# EAGLE design Sensor_IBIS5 (EAGLE 9.6.2)
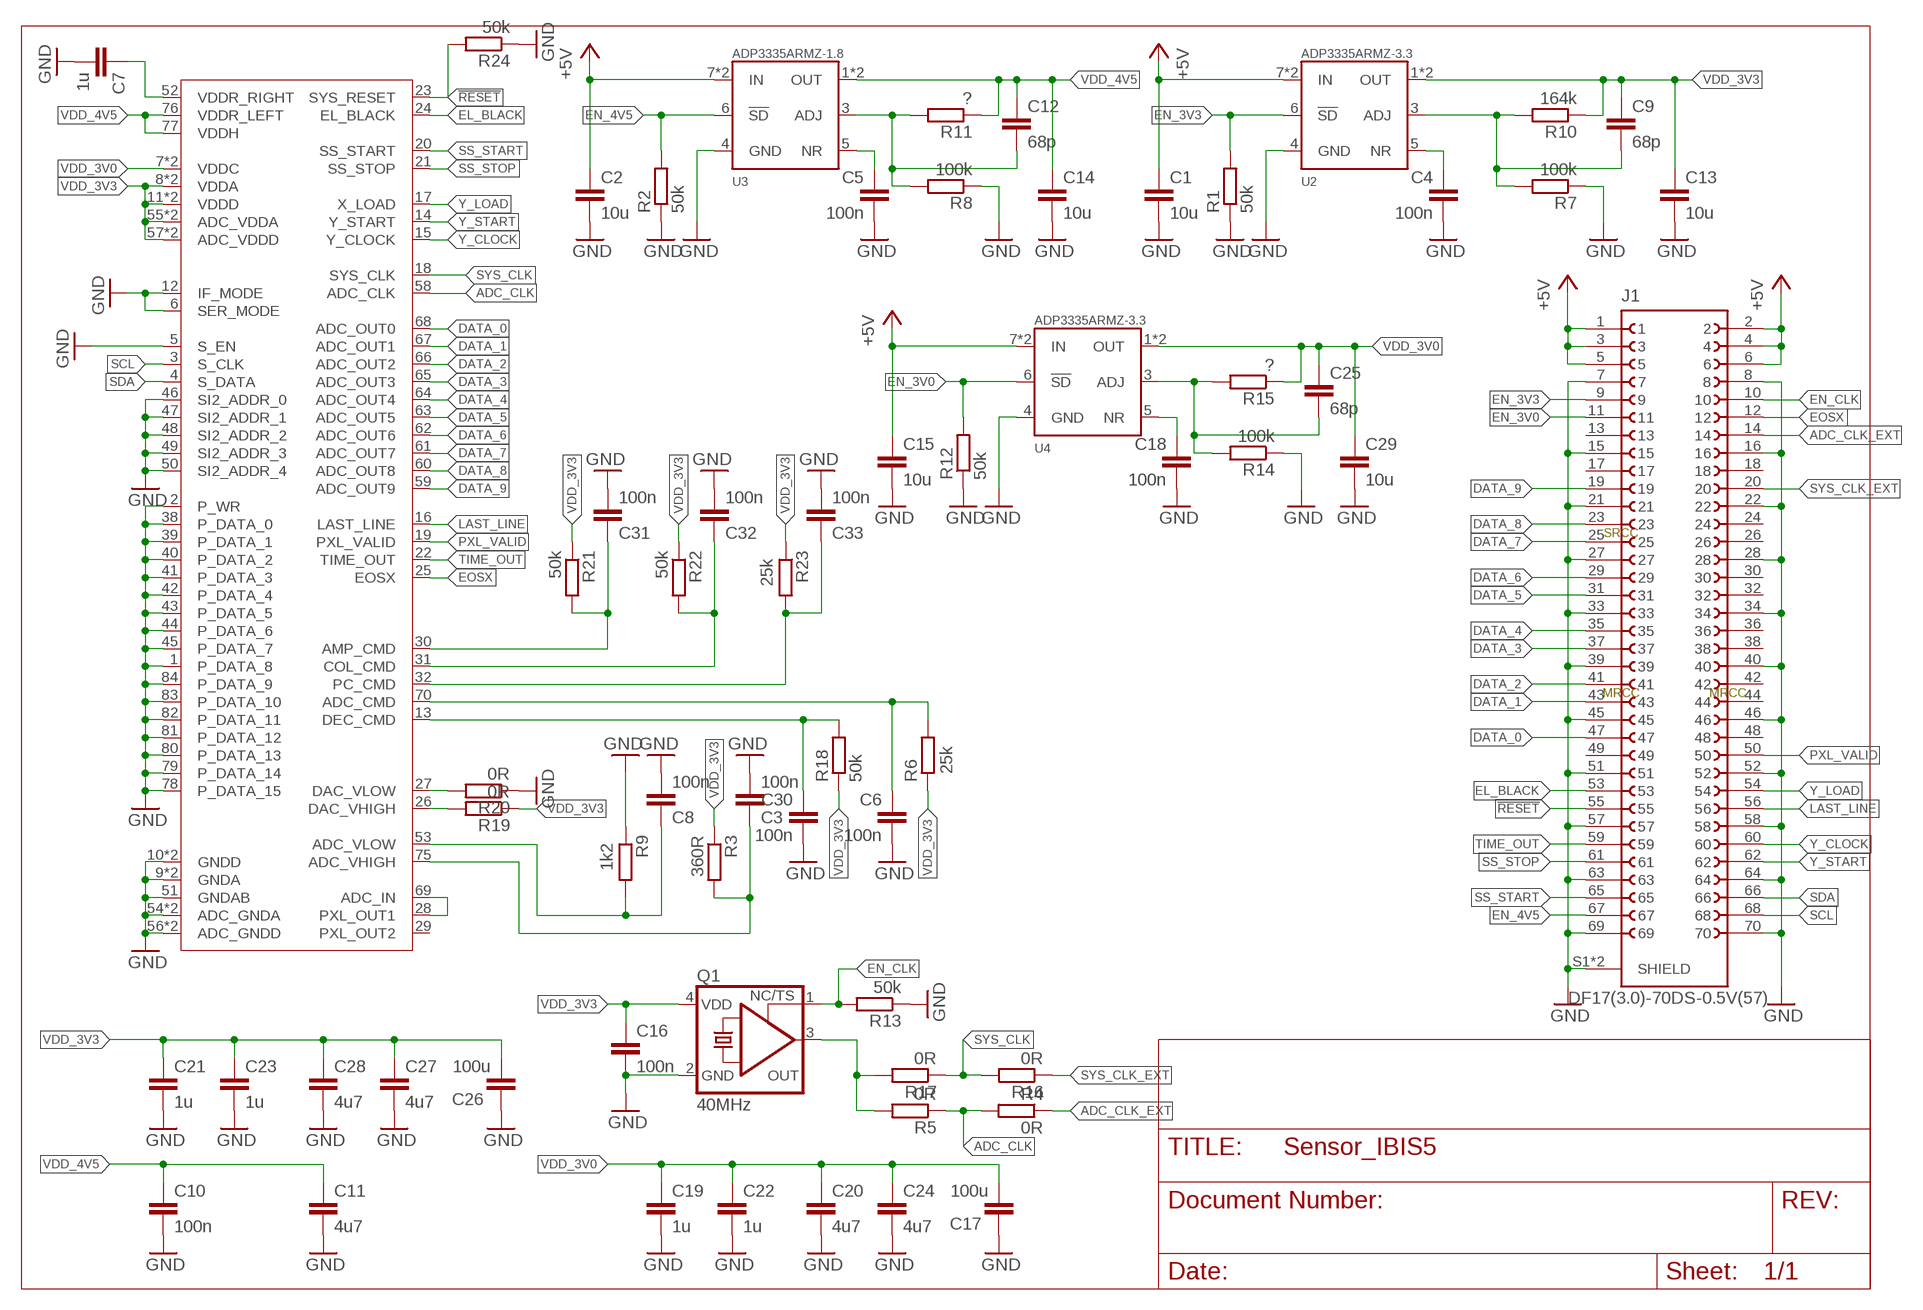
[diagram p0: schematic, sheet 1]

## Parts
C1  10u  C-EUC0603  [C0603]
C2  10u  C-EUC0603  [C0603]
C3  100n  C-EUC0402  [C0402]
C4  100n  C-EUC0402  [C0402]
C5  100n  C-EUC0402  [C0402]
C6  100n  C-EUC0402  [C0402]
C7  1u  C-EUC0402  [C0402]
C8  100n  C-EUC0402  [C0402]
C9  68p  C-EUC0402  [C0402]
C10  100n  C-EUC0402  [C0402]
C11  4u7  C-EUC0603  [C0603]
C12  68p  C-EUC0402  [C0402]
C13  10u  C-EUC0603  [C0603]
C14  10u  C-EUC0603  [C0603]
C15  10u  C-EUC0603  [C0603]
C16  100n  C-EUC0402  [C0402]
C17  100u  C-EUC1206  [C1206]
C18  100n  C-EUC0402  [C0402]
C19  1u  C-EUC0402  [C0402]
C20  4u7  C-EUC0603  [C0603]
C21  1u  C-EUC0402  [C0402]
C22  1u  C-EUC0402  [C0402]
C23  1u  C-EUC0402  [C0402]
C24  4u7  C-EUC0603  [C0603]
C25  68p  C-EUC0402  [C0402]
C26  100u  C-EUC1206  [C1206]
C27  4u7  C-EUC0603  [C0603]
C28  4u7  C-EUC0603  [C0603]
C29  10u  C-EUC0603  [C0603]
C30  100n  C-EUC0402  [C0402]
C31  100n  C-EUC0402  [C0402]
C32  100n  C-EUC0402  [C0402]
C33  100n  C-EUC0402  [C0402]
J1  DF17(3.0)-70DS-0.5V(57)  [DF17(3.0)-70DS-0.5V(57)]
Q1  40MHz  KXO-PXO/XO-V96  [3.2X2.5_KXO-V96]
R1  50k  R-EU_R0402  [R0402]
R2  50k  R-EU_R0402  [R0402]
R3  360R  R-EU_R0402  [R0402]
R4  0R  R-EU_R0402  [R0402]
R5  0R  R-EU_R0402  [R0402]
R6  25k  R-EU_R0402  [R0402]
R7  100k  R-EU_R0402  [R0402]
R8  100k  R-EU_R0402  [R0402]
R9  1k2  R-EU_R0402  [R0402]
R10  164k  R-EU_R0402  [R0402]
R11  ?  R-EU_R0402  [R0402]
R12  50k  R-EU_R0402  [R0402]
R13  50k  R-EU_R0402  [R0402]
R14  100k  R-EU_R0402  [R0402]
R15  ?  R-EU_R0402  [R0402]
R16  0R  R-EU_R0402  [R0402]
R17  0R  R-EU_R0402  [R0402]
R18  50k  R-EU_R0402  [R0402]
R19  0R  R-EU_R0402  [R0402]
R20  0R  R-EU_R0402  [R0402]
R21  50k  R-EU_R0402  [R0402]
R22  50k  R-EU_R0402  [R0402]
R23  25k  R-EU_R0402  [R0402]
R24  50k  R-EU_R0402  [R0402]
U1  CYII5FM1300AB  [LCC-84]
U2  ADP3335ARMZ-3.3  NCP3335  [MSOP08]
U3  ADP3335ARMZ-1.8  NCP3335  [MSOP08]
U4  ADP3335ARMZ-3.3  NCP3335  [MSOP08]

## Nets
!RESET: J1.55 R24.2 U1.23(SYS_RESET)
+5V: C1.1 C2.1 C15.1 J1.1 J1.2 J1.3 J1.4 J1.5 J1.6 U2.7(IN) U2.8(IN) U3.7(IN) U3.8(IN) U4.7(IN) U4.8(IN)
ADC_CLK: R4.2 R5.1 U1.58(ADC_CLK)
ADC_CLK_EXT: J1.14 R4.1
CLK: Q1.3(OUT) R5.2 R17.2
DATA_0: J1.47 U1.68(ADC_OUT0)
DATA_1: J1.43 U1.67(ADC_OUT1)
DATA_2: J1.41 U1.66(ADC_OUT2)
DATA_3: J1.37 U1.65(ADC_OUT3)
DATA_4: J1.35 U1.64(ADC_OUT4)
DATA_5: J1.31 U1.63(ADC_OUT5)
DATA_6: J1.29 U1.62(ADC_OUT6)
DATA_7: J1.25 U1.61(ADC_OUT7)
DATA_8: J1.23 U1.60(ADC_OUT8)
DATA_9: J1.19 U1.59(ADC_OUT9)
EL_BLACK: J1.53 U1.24(EL_BLACK)
EN_3V0: J1.11 R12.2 U4.6(!SD)
EN_3V3: J1.9 R1.2 U2.6(!SD)
EN_4V5: J1.67 R2.2 U3.6(!SD)
EN_CLK: J1.10 Q1.1(TS) R13.2
EOSX: J1.12 U1.25(EOSX)
GND: C1.2 C2.2 C3.2 C4.2 C5.2 C6.2 C7.2 C8.2 C10.2 C11.2 C13.2 C14.2 C15.2 C16.2 C17.2 C18.2 C19.2 C20.2 C21.2 C22.2 C23.2 C24.2 C26.2 C27.2 C28.2 C29.2 C30.2 C31.2 C32.2 C33.2 J1.7 J1.8 J1.15 J1.16 J1.21 J1.22 J1.27 J1.28 J1.33 J1.34 J1.39 J1.40 J1.45 J1.46 J1.51 J1.52 J1.57 J1.58 J1.63 J1.64 J1.69 J1.70 J1.S1(SHIELD) J1.S2(SHIELD) Q1.2(GND) R1.1 R2.1 R7.1 R8.1 R9.1 R12.1 R13.1 R14.1 R20.1 R24.1 U1.1(P_DATA_8) U1.2(P_WR) U1.5(S_EN) U1.6(SER_MODE) U1.9(GNDA) U1.10(GNDD) U1.12(IF_MODE) U1.34(GNDD) U1.35(GNDA) U1.38(P_DATA_0) U1.39(P_DATA_1) U1.40(P_DATA_2) U1.41(P_DATA_3) U1.42(P_DATA_4) U1.43(P_DATA_5) U1.44(P_DATA_6) U1.45(P_DATA_7) U1.46(SI2_ADDR_0) U1.47(SI2_ADDR_1) U1.48(SI2_ADDR_2) U1.49(SI2_ADDR_3) U1.50(SI2_ADDR_4) U1.51(GNDAB) U1.54(ADC_GNDA) U1.56(ADC_GNDD) U1.72(ADC_GNDA) U1.73(ADC_GNDD) U1.78(P_DATA_15) U1.79(P_DATA_14) U1.80(P_DATA_13) U1.81(P_DATA_12) U1.82(P_DATA_11) U1.83(P_DATA_10) U1.84(P_DATA_9) U2.4(GND) U3.4(GND) U4.4(GND)
LAST_LINE: J1.56 U1.16(LAST_LINE)
N$00001: U1.28(PXL_OUT1) U1.69(ADC_IN)
N$00002: C18.1 U4.5(NR)
N$00003: C5.1 U3.5(NR)
N$00004: C4.1 U2.5(NR)
N$00005: R19.2 U1.26(DAC_VHIGH)
N$00006: R20.2 U1.27(DAC_VLOW)
N$00007: C30.1 R18.2 U1.13(DEC_CMD)
N$00008: C32.1 R22.2 U1.31(COL_CMD)
N$00009: C33.1 R23.2 U1.32(PC_CMD)
N$00010: C31.1 R21.2 U1.30(AMP_CMD)
N$00011: C6.1 R6.2 U1.70(ADC_CMD)
N$00012: C3.1 R3.2 U1.75(ADC_VHIGH)
N$00013: C8.1 R9.2 U1.53(ADC_VLOW)
N$00014: C7.1 U1.52(VDDR_RIGHT)
N$00015: C12.2 R8.2 R11.2 U3.3(ADJ)
N$00016: C9.2 R7.2 R10.2 U2.3(ADJ)
N$00017: C25.2 R14.2 R15.2 U4.3(ADJ)
PXL_VALID: J1.50 U1.19(PXL_VALID)
SCL: J1.68 U1.3(S_CLK)
SDA: J1.66 U1.4(S_DATA)
SS_START: J1.65 U1.20(SS_START)
SS_STOP: J1.61 U1.21(SS_STOP)
SYS_CLK: R16.2 R17.1 U1.18(SYS_CLK)
SYS_CLK_EXT: J1.20 R16.1
TIME_OUT: J1.59 U1.22(TIME_OUT)
VDD_3V0: C17.1 C19.1 C20.1 C22.1 C24.1 C25.1 C29.1 R15.1 U1.7(VDDC) U1.37(VDDC) U4.1(OUT) U4.2(OUT)
VDD_3V3: C9.1 C13.1 C16.1 C21.1 C23.1 C26.1 C27.1 C28.1 Q1.4(VDD) R3.1 R6.1 R10.1 R18.1 R19.1 R21.1 R22.1 R23.1 U1.8(VDDA) U1.11(VDDD) U1.33(VDDD) U1.36(VDDA) U1.55(ADC_VDDA) U1.57(ADC_VDDD) U1.71(ADC_VDDD) U1.74(ADC_VDDA) U2.1(OUT) U2.2(OUT)
VDD_4V5: C10.1 C11.1 C12.1 C14.1 R11.1 U1.76(VDDR_LEFT) U1.77(VDDH) U3.1(OUT) U3.2(OUT)
Y_CLOCK: J1.60 U1.15(Y_CLOCK)
Y_LOAD: J1.54 U1.17(X_LOAD)
Y_START: J1.62 U1.14(Y_START)
Unconnected: J1.13 J1.17 J1.18 J1.24 J1.26 J1.30 J1.32 J1.36 J1.38 J1.42 J1.44 J1.48 J1.49 U1.29(PXL_OUT2)

## Notes on the sheet
- SRCC
- MRCC | MRCC

## Library data of the parts
C1 C2 C7 C13-C15 C19 C21-C23 C29 = rcl:C-EU: CAPACITOR, European symbol; SPICEPREFIX: C
C3-C6 C8-C10 C12 C18 C25 C30-C33 = rcl:C-EU: CAPACITOR, European symbol; LCSC: C1525; SPICEPREFIX: C
C11 C20 C24 C27 C28 = rcl:C-EU: CAPACITOR, European symbol; LCSC: C19666; SPICEPREFIX: C
C16 = rcl:C-EU: CAPACITOR, European symbol; LCSC: C1525
C17 C26 = rcl:C-EU: CAPACITOR, European symbol; DIGIKEY: 490-GRM31CD80J107MEA8LCT-ND; LCSC: C15008; SPICEPREFIX: C
J1 = Hirose:DF17(3.0)-70DS-0.5V(57)
Q1 = crystal-geyer_V1_0:KXO-PXO/XO-V: Clock Oscillator (PXO/XO) MHz : KXO-V - Serie Model Size l/w/h [mm] Frequency Range Frequency Stability Temp. Range [°C] Output AECQ 200 availabel Datasheet KXO-V94 KXO-V94 KXO-V95 KXO-V95 KXO-V96 KXO-V96 KXO-V99 KXO-V99 KXO-97 KXO-V97 KXO-97 - KXO-V97 2.0/1.6/0.80 2.0/1.6/0.80 2.5/2.0/0.82 2.5/2.0/0.82 3.2/2.5/1.2 3.2/2.5/1.2 5.0/3.2/1.2 5.0/3.2/1.2 7.0/5.08/1.3 7.0/5.08/1.3 7.0/5.08/1.3 32,768 kHz 1,0 ~ 80,0 MHz 32,768 kHz 1,0 ~ 70,0 MHz 32,768 kHz 1,0 ~ 156,0 MHz 32,768 kHz 1,0 ~ 200,0 MHz 32,768 kHz 32,768 kHz 1,0 ~ 160,0 MHz ±25 … ±100ppm ±25 … ±100ppm ±25 … ±100ppm ±25 … ±100ppm ±25 … ±100ppm ±25 … ±100ppm ±25 … ±100ppm ±25 … ±100ppm ±25 … ±100ppm ±25 … ±100ppm ±25 … ±100ppm (*) -40°C …+85°C (*) -40°C …+85°C (*) -40°C …+85°C (*) -40°C …+85°C (*) -40°C …+85°C (*) -40°C …+85°C (*) -40°C …+85°C (*) -40°C …+85°C (*) -40°C …+85°C (*) -40°C …+85°C (*) -40°C …+85°C HCMOS HCMOS HCMOS HCMOS HCMOS HCMOS HCMOS HCMOS HCMOS HCMOS HCMOS - - yes yes yes yes - - - - - KXO-V94-kHz.pdf <http://www.geyer-electronic.de/uploads/tx_userartikelfrequenz/GEYER-KXO-V94-kHz.pdf> KXO-V94.pdf <http://www.geyer-electronic.de/uploads/tx_userartikelfrequenz/GEYER-KXO-V94.pdf> KXO-V95-kHz.pdf <http://www.geyer-electronic.de/uploads/tx_userartikelfrequenz/GEYER-KXO-V95-kHz.pdf> KXO-V95.pdf <http://www.geyer-electronic.de/uploads/tx_userartikelfrequenz/GEYER-KXO-V95.pdf> KXO-V96-kHz.pdf <http://www.geyer-electronic.de/uploads/tx_userartikelfrequenz/GEYER-KXO-V96-kHz.pdf> KXO-V96.pdf <http://www.geyer-electronic.de/uploads/tx_userartikelfrequenz/GEYER-KXO-V96.pdf> KXO-V99-kHz.pdf <http://www.geyer-electronic.de/uploads/tx_userartikelfrequenz/GEYER-KXO-V99-kHz.pdf> KXO-V99.pdf <http://www.geyer-electronic.de/uploads/tx_userartikelfrequenz/GEYER-KXO-V99.pdf> KXO-97-kHz.pdf <http://www.geyer-electronic.de/uploads/tx_userartikelfrequenz/GEYER-KXO-97-kHz.pdf> KXO-V97-kHz.pdf <http://www.geyer-electronic.de/uploads/tx_userartikelfrequenz/GEYER-KXO-V97-kHz.pdf> KXO-V97.pdf <http://www.geyer-electronic.de/uploads/tx_userartikelfrequenz/GEYER-KXO-V97.pdf> <http://www.geyer-electronic.de/fileadmin/template/img/logo-geyer-electronic.png> Details see: http://www.geyer-electronic.de/Frequenz-Produkte.9.0.html Created 2016-06-07, Hans Locher 2016 (C) Geyer Quartz Technology Hans Locher KXOV94,KXOV95;KXOV96;KXOV97;KXO97;2016;2520;3225;5032;70508;2,5x2,0;3,2x2,5;5,0x3,2;7,0x5,08;2.5x2.0;3.2x2.5;5.0x3.2;7.0x5.08;; DIGIKEY: 1473-SIT8208AC-23-33E-72.000000-ND
R1-R24 = rcl:R-EU_: RESISTOR, European symbol; SPICEPREFIX: R
U1 = cypress:CYII5FM1300AB: IBIS5-B-1300 / CYII5FM1300AB 1.3 MP CMOS Image Sensor
U2 U4 = analog_devices:NCP3335: NCP3335 Low Dropout Regulator - Ultra High Accuracy, Low Iq, 500 mA; DIGIKEY: 505-ADP3335ARMZ-3.3RL7CT-ND
U3 = analog_devices:NCP3335: NCP3335 Low Dropout Regulator - Ultra High Accuracy, Low Iq, 500 mA; DIGIKEY: 505-ADP3335ARMZ-1.8-R7CT-ND

## Board
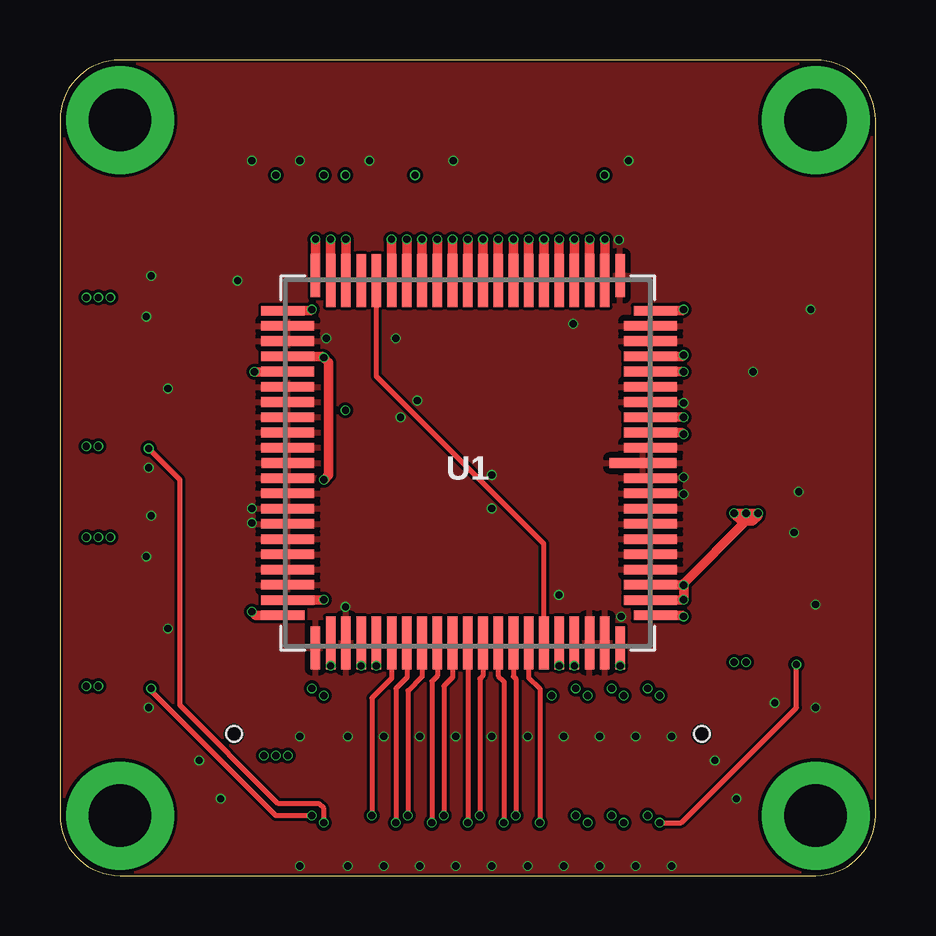
[diagram p1: board, top side]
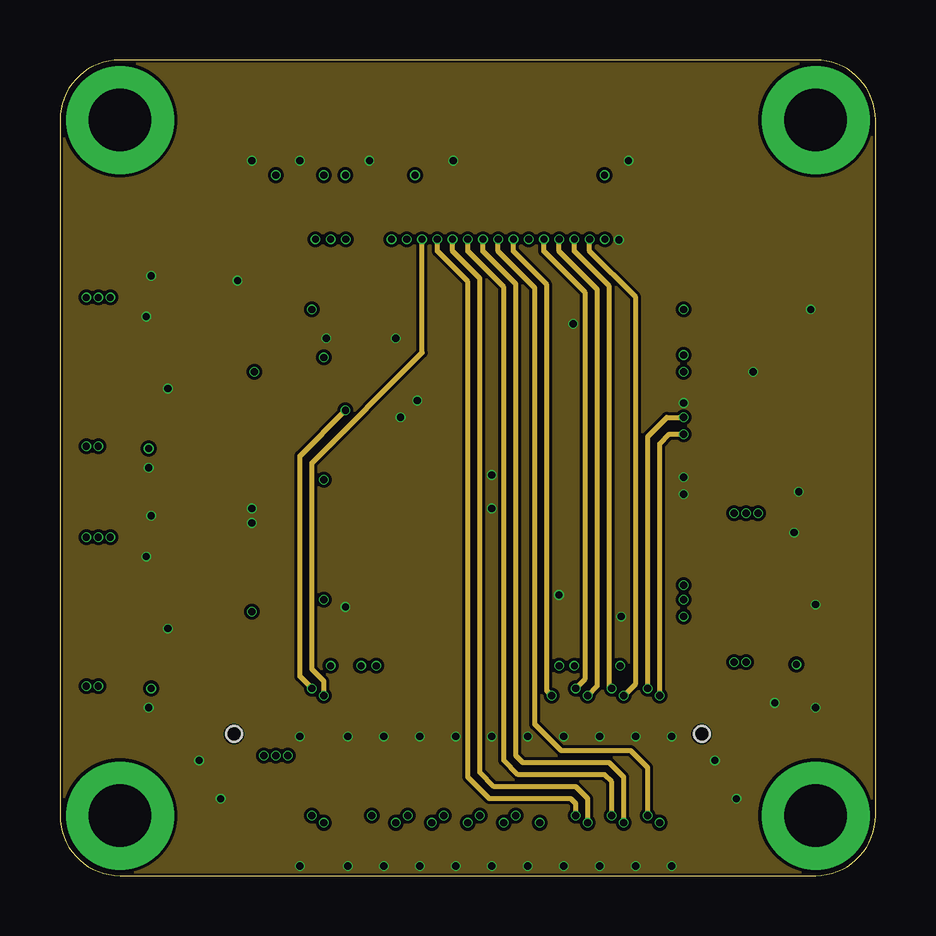
[diagram p2: board, inner layer Route2]
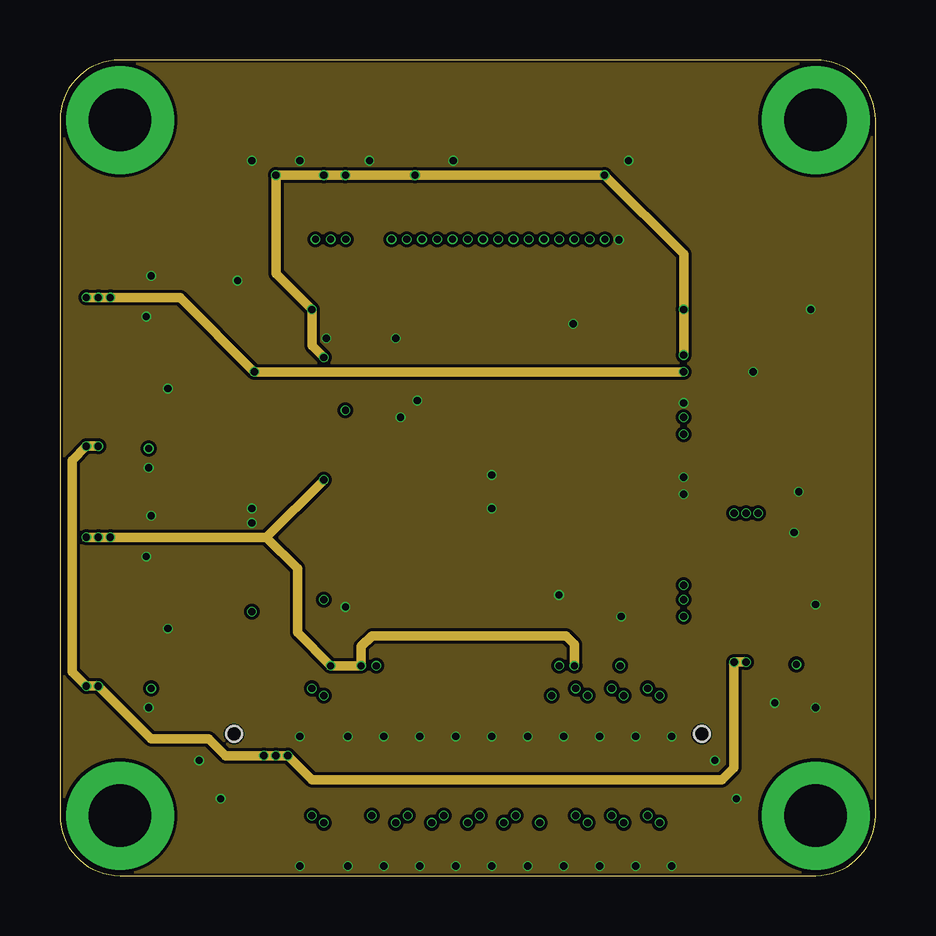
[diagram p3: board, inner layer Route15]
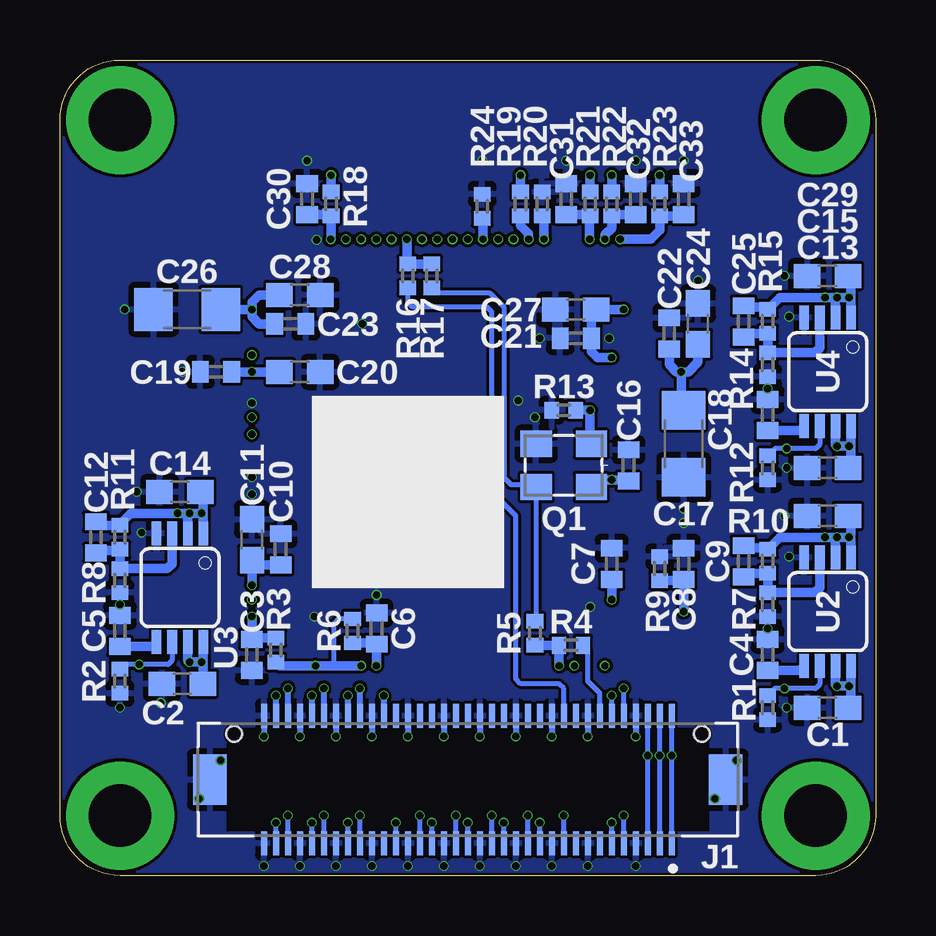
[diagram p4: board, bottom side, seen from below]

Size 34 x 34 mm. Coordinates in mm from the lower left corner, seen from the top.
Outline: 0,31.5 0,2.5 arc90 2.5,0 31.5,0 arc90 34,2.5 34,31.5 arc90 31.5,34 2.5,34 arc90 0,31.5
Copper layers (1*2*15*16): Top 0.035559375mm / dielectric 0.17018125mm / Route2 0.01778125mm / dielectric 47mil / Route15 0.01778125mm / dielectric 0.17018125mm / Bottom 0.035559375mm
Design rules "jlcpcb-4-layer *": minimum track width 5mil, minimum drill 0.2mm, track to track 5mil, track to pad 5mil, pad to pad 5mil, via to via 5mil, smd to smd 0mil, copper to edge 0.1mm, drill to drill 5mil, minimum pad ring 0.1mm, minimum via ring 0.05mm, stop-mask expansion 3mil, vias tented up to drill 100mil, thermal gap 10mil

### Footprints (pad centres in the part's own frame; a part is rotated, then mirrored left to right if it is on the bottom)
C0603 = smd 1.1 x 1: 1 -0.85,0; 2 0.85,0
C0402 = smd 0.7 x 0.9: 1 -0.65,0; 2 0.65,0
C1206 = smd 1.6 x 1.8: 1 -1.4,0; 2 1.4,0
DF17(3.0)-70DS-0.5V(57) = smd 0.25 x 1: 1 -8.5,2.65; 2 -8.5,-2.65; 3 -8,2.65; 4 -8,-2.65; 5 -7.5,2.65; 6 -7.5,-2.65; 7 -7,2.65; 8 -7,-2.65; 9 -6.5,2.65; 10 -6.5,-2.65; 11 -6,2.65; 12 -6,-2.65; 13 -5.5,2.65; 14 -5.5,-2.65; 15 -5,2.65; 16 -5,-2.65; 17 -4.5,2.65; 18 -4.5,-2.65; 19 -4,2.65; 20 -4,-2.65; 21 -3.5,2.65; 22 -3.5,-2.65; 23 -3,2.65; 24 -3,-2.65; 25 -2.5,2.65; 26 -2.5,-2.65; 27 -2,2.65; 28 -2,-2.65; 29 -1.5,2.65; 30 -1.5,-2.65; 31 -1,2.65; 32 -1,-2.65; 33 -0.5,2.65; 34 -0.5,-2.65; 35 0,2.65; 36 0,-2.65; 37 0.5,2.65; 38 0.5,-2.65; 39 1,2.65; 40 1,-2.65; 41 1.5,2.65; 42 1.5,-2.65; 43 2,2.65; 44 2,-2.65; 45 2.5,2.65; 46 2.5,-2.65; 47 3,2.65; 48 3,-2.65; 49 3.5,2.65; 50 3.5,-2.65; 51 4,2.65; 52 4,-2.65; 53 4.5,2.65; 54 4.5,-2.65; 55 5,2.65; 56 5,-2.65; 57 5.5,2.65; 58 5.5,-2.65; 59 6,2.65; 60 6,-2.65; 61 6.5,2.65; 62 6.5,-2.65; 63 7,2.65; 64 7,-2.65; 65 7.5,2.65; 66 7.5,-2.65; 67 8,2.65; 68 8,-2.65; 69 8.5,2.65; 70 8.5,-2.65 | smd 1.4 x 2.1: S1 -10.75,0; S2 10.75,0 | hole 0.65: -9.75,-1.9; 9.75,-1.9
3.2X2.5_KXO-V96 = smd 1.3 x 1.1: 1 -1.15,-0.9; 2 1.15,-0.9; 3 1.15,0.9; 4 -1.15,0.9
R0402 = smd 0.6 x 0.7: 1 -0.5,0; 2 0.5,0
LCC-84 = smd 0.4 x 2.8: 1 0,7.3 | smd 0.4 x 2.2: 2 -0.635,7.62; 3 -1.27,7.62; 4 -1.905,7.62; 5 -2.54,7.62; 6 -3.175,7.62; 7 -3.81,7.62; 8 -4.445,7.62; 9 -5.08,7.62; 10 -5.715,7.62; 34 -5.715,-7.505; 35 -5.08,-7.505; 36 -4.445,-7.505; 37 -3.81,-7.505; 38 -3.175,-7.505; 39 -2.54,-7.505; 40 -1.905,-7.505; 41 -1.27,-7.505; 42 -0.635,-7.505; 43 0,-7.5; 44 0.635,-7.505; 45 1.27,-7.505; 46 1.905,-7.505; 47 2.54,-7.505; 48 3.175,-7.505; 49 3.81,-7.505; 50 4.445,-7.505; 51 5.08,-7.505; 52 5.715,-7.505; 76 5.715,7.62; 77 5.08,7.62; 78 4.445,7.62; 79 3.81,7.62; 80 3.175,7.62; 81 2.54,7.62; 82 1.905,7.62; 83 1.27,7.62; 84 0.635,7.62 | smd 0.4 x 1.8: 11 -6.35,7.82; 33 -6.35,-7.705; 53 6.35,-7.705; 75 6.35,7.82 | smd 1.8 x 0.4: 12 -7.805,6.35; 32 -7.805,-6.35; 54 7.705,-6.35; 74 7.705,6.35 | smd 2.2 x 0.4: 13 -7.605,5.715; 14 -7.605,5.08; 15 -7.605,4.445; 16 -7.605,3.81; 17 -7.605,3.175; 18 -7.605,2.54; 19 -7.605,1.905; 20 -7.605,1.27; 21 -7.605,0.635; 22 -7.605,0; 23 -7.605,-0.635; 24 -7.605,-1.27; 25 -7.605,-1.905; 26 -7.605,-2.54; 27 -7.605,-3.175; 28 -7.605,-3.81; 29 -7.605,-4.445; 30 -7.605,-5.08; 31 -7.605,-5.715; 55 7.505,-5.715; 56 7.505,-5.08; 57 7.505,-4.445; 58 7.505,-3.81; 59 7.505,-3.175; 60 7.505,-2.54; 61 7.505,-1.905; 62 7.505,-1.27; 63 7.505,-0.635; 64 7.5,0; 65 7.505,0.635; 66 7.505,1.27; 67 7.505,1.905; 68 7.505,2.54; 69 7.505,3.175; 70 7.505,3.81; 71 7.505,4.445; 72 7.505,5.08; 73 7.505,5.715
MSOP08 = smd 0.4 x 1: 1 -0.976,-2.263; 2 -0.326,-2.263; 3 0.324,-2.263; 4 0.974,-2.263; 5 0.974,2.262; 6 0.324,2.262; 7 -0.326,2.262; 8 -0.976,2.262

### Placement (x,y rotation side)
C1  2,7 180 bottom
C2  28.9,8 180 bottom
C3  26,9.2 270 bottom
C4  4.5,9.2 90 bottom
C5  31.5,10.2 90 bottom
C6  20.8,10.3 90 bottom
C7  11,13 90 bottom
C8  8,13 90 bottom
C9  5.5,13.1 270 bottom
C10  24.8,13.6 90 bottom
C11  26,14 90 bottom
C12  32.5,14.1 270 bottom
C13  2,15 180 bottom
C14  29,16 180 bottom
C15  2,17 180 bottom
C16  10.3,17.1 90 bottom
C17  8,18 270 bottom
C18  4.5,19.2 90 bottom
C19  27.5,21 180 bottom
C20  24,21 0 bottom
C21  12.5,22.4 180 bottom
C22  8.6,22.6 90 bottom
C23  24.4,23 0 bottom
C24  7.4,23 90 bottom
C25  5.5,23.1 270 bottom
C26  28.7,23.6 180 bottom
C27  12.5,23.6 180 bottom
C28  24,24.2 0 bottom
C29  2,25 180 bottom
C30  23.7,28.2 90 bottom
C31  12.9,28.2 90 bottom
C32  10,28.2 90 bottom
C33  8,28.2 90 bottom
J1  17,4 180 bottom
Q1  13,17.1 180 bottom
R1  4.5,7 90 bottom
R2  31.5,8.1 90 bottom
R3  25,9.4 90 bottom
R4  12.7,9.6 180 bottom
R5  14.2,10.1 90 bottom
R6  21.8,10.2 270 bottom
R7  4.5,11.3 90 bottom
R8  31.5,12.3 90 bottom
R9  9,12.8 270 bottom
R10  4.5,13.1 270 bottom
R11  31.5,14.1 270 bottom
R12  4.5,17 90 bottom
R13  13,19.4 0 bottom
R14  4.5,21.3 90 bottom
R15  4.5,23.1 270 bottom
R16  19.5,25 90 bottom
R17  18.5,25 270 bottom
R18  22.7,28 270 bottom
R19  14.8,28 270 bottom
R20  13.9,28 270 bottom
R21  11.9,28 270 bottom
R22  11,28 270 bottom
R23  9,28 270 bottom
R24  16.4,27.9 270 bottom
U1  17,17.2 270 top
U2  2,11 180 bottom
U3  29,12 180 bottom
U4  2,21 180 bottom

### Tracks (layer width: path | path; a pad name or v marks a point on that pad's centre or on a via)
!RESET  (via drill 0.3)
  Top 0.4: U1.23 v16.36,26.52
  Route2 0.2: v22,2.2 22,3.2 21.5,3.7 18.1,3.7 17.5,4.3 17.5,24.89 16.36,26.02 v16.36,26.52
  Bottom 0.2: J1.55 v22,2.2
  Bottom 0.4: v16.36,26.52 16.36,27.37 R24.2
+5V  (via drill 0.3)
  Route15 0.4: v1.6,17.9 v1.1,17.9 0.5,17.3 0.5,8.5 v1.1,7.9 v1.6,7.9 3.8,5.7 6.2,5.7 6.9,5 v8.5,5 v9,5 v9.5,5 10.5,4 27.6,4 28.1,4.5 v28.1,8.9 v28.6,8.9
  Bottom 0.2: J1.1 v8.5,5 J1.2 | J1.3 v9,5 J1.4 | J1.5 v9.5,5 J1.6
  Bottom 0.4: U4.8 1.02,17.9 | 1.02,17.9 1.02,17.13 C15.1 | U3.8 28.02,8.9 | 28.02,8.9 28.02,8.03 | 28.02,8.03 C2.1 28.3,7.75 | U2.8 1.02,7.9 | 1.02,7.9 1.02,7.13 C1.1 1.2,6.95 1.2,6.9 | C15.1 0.9,16.75 | 1.4,16.75 C15.1 | 27.8,7.8 28.02,8.03 | U2.7 1.67,7.97 v1.6,7.9 v1.1,7.9 1.02,7.9 | U4.7 1.67,17.97 v1.6,17.9 v1.1,17.9 1.02,17.9 | U3.7 28.67,8.97 v28.6,8.9 v28.1,8.9 28.02,8.9
ADC_CLK  (via drill 0.3)
  Top 0.4: U1.58 v13.19,8.74
  Bottom 0.4: R5.1 R4.2 v13.19,8.74
ADC_CLK_EXT
  Bottom 0.2: J1.14 11.5,7.6 12,8.1 12,9.4 R4.1
CLK
  Bottom 0.2: R17.2 18.3,24.3 16.1,24.3 15.5,23.7 15.5,16.6 15.2,16.3 14.25,16.3 Q1.3 14.15,10.65 R5.2
DATA_0  (via drill 0.3)
  Top 0.2: U1.68 19.54,8.26 20,7.8 v20,2.2
  Bottom 0.2: J1.47 v20,2.2
DATA_1  (via drill 0.3)
  Top 0.2: U1.67 18.91,8.29 19,8.2 v19,2.5
  Bottom 0.2: J1.43 v19,2.5
DATA_2  (via drill 0.3)
  Top 0.2: U1.66 18.27,8.33 18.5,8.1 v18.5,2.2
  Bottom 0.2: J1.41 v18.5,2.2
DATA_3  (via drill 0.3)
  Top 0.2: U1.65 17.64,8.34 17.5,8.2 v17.5,2.5
  Bottom 0.2: J1.37 v17.5,2.5
DATA_4  (via drill 0.3)
  Top 0.2: U1.64 v17,2.2
  Bottom 0.2: J1.35 v17,2.2
DATA_5  (via drill 0.3)
  Top 0.2: U1.63 16.36,8.27 16,7.9 v16,2.5
  Bottom 0.2: J1.31 v16,2.5
DATA_6  (via drill 0.3)
  Top 0.2: U1.62 15.73,8.33 15.5,8.1 v15.5,2.2
  Bottom 0.2: J1.29 v15.5,2.2
DATA_7  (via drill 0.3)
  Top 0.2: U1.61 15.1,8.29 14.5,7.7 v14.5,2.5
  Bottom 0.2: J1.25 v14.5,2.5
DATA_8  (via drill 0.3)
  Top 0.2: U1.60 14.46,8.26 14,7.8 v14,2.2
  Bottom 0.2: J1.23 v14,2.2
DATA_9  (via drill 0.3)
  Top 0.2: U1.59 13.82,8.22 13,7.4 v13,2.5
  Bottom 0.2: J1.19 v13,2.5
EL_BLACK  (via drill 0.3)
  Top 0.4: U1.24 v15.73,26.52
  Route2 0.2: v21.5,2.5 21.5,3 21.3,3.2 17.9,3.2 17,4.1 17,24.75 15.73,26.02 v15.73,26.52
  Bottom 0.2: J1.53 v21.5,2.5
EN_3V0  (via drill 0.3)
  Top 0.2: v11,2.2 11,2.8 10.8,3 9.1,3 5,7.1 5,16.5 v3.7,17.8
  Bottom 0.2: U4.6 2.32,17.98 2.5,17.8 v3.7,17.8 4.2,17.8 R12.2 | J1.11 v11,2.2
EN_3V3  (via drill 0.3)
  Top 0.2: v10.5,2.5 9,2.5 3.8,7.7 v3.8,7.8
  Bottom 0.2: U2.6 2.32,7.98 2.5,7.8 v3.8,7.8 4.2,7.8 R1.2 | J1.9 v10.5,2.5
EN_4V5  (via drill 0.3)
  Top 0.2: v25,2.2 25.9,2.2 30.7,7 v30.7,8.8
  Bottom 0.2: R2.2 31.5,8.8 v30.7,8.8 29.5,8.8 29.32,8.98 U3.6 | J1.67 v25,2.2
EN_CLK  (via drill 0.3)
  Route2 0.2: v10.5,7.8 10,8.3 10,17.5 v11.9,19.4
  Bottom 0.2: J1.10 v10.5,7.8
  Bottom 0.4: R13.2 v11.9,19.4 11.9,18.05 Q1.1
EOSX  (via drill 0.3)
  Top 0.4: U1.25 v15.1,26.52
  Route2 0.2: v11,7.5 11,8.1 10.5,8.6 10.5,17.2 15.1,21.8 v15.1,26.52
  Bottom 0.2: J1.12 v11,7.5
GND  (via drill 0.3)
  Bottom 0.25: J1.40 v18,5.8 | J1.46 v19.5,5.8 | J1.52 v21,5.8 | J1.58 v22.5,5.8 | J1.34 v16.5,5.8 | J1.64 v24,5.8 | J1.28 v15,5.8 | J1.22 v13.5,5.8 | J1.70 v25.5,5.8 | J1.16 v12,5.8 | J1.8 v10,5.8
  other vias: 15,0.4 16.5,0.4 18,0.4 19.5,0.4 21,0.4 22.5,0.4 24,0.4 5.8,4.8 6.7,3.2 27.3,4.8 28.2,3.2 13.5,0.4 12,0.4 10,0.4 25.5,0.4 3.6,13.3 3.6,23.3 30.6,14.3 21.4,23 7.4,24.8 3.8,25 3.8,15 3.7,17 3.7,7 8,15.3 20.8,11.7 26,16.6 30.8,16 29.8,7.2 31.5,7 28.9,21 31.3,23.6 23.3,26.5 11.1,22.4 26,19.7 26,15.9 23.4,10.8 11.9,11.2 8,14.7 14,22.4 14.2,19.1 14.9,19.8 18,15.3 18,16.7 8,29.8 10,29.8 12.9,29.8 16.4,29.8 23.7,29.8 4.5,20.3 4.5,10.3 31.5,11.3
  pour Top: 0,0 34,0 34,34 0,34
  pour Bottom: 0,0 34,0 34,34 0,34
  pour Route15 (rank 2): 0,0 34,0 34,34 0,34
  pour Route2: 0,0 34,0 34,34 0,34
LAST_LINE  (via drill 0.3)
  Top 0.4: U1.16 v20.81,26.52
  Route2 0.2: v22,7.5 22.4,7.9 22.4,24.43 20.81,26.02 v20.81,26.52
  Bottom 0.25: J1.56 v22,7.5
N$00001
  Top 0.2: U1.69 20.18,13.82 13.19,20.81 U1.28
N$00002
  Bottom 0.4: U4.5 3.16,18.55 C18.1
N$00003
  Bottom 0.4: C5.1 30.16,9.55 U3.5
N$00004
  Bottom 0.4: U2.5 3.16,8.55 C4.1
N$00005  (via drill 0.3)
  Top 0.4: U1.26 v14.46,26.52
  Bottom 0.4: v14.46,26.52 14.46,26.76 14.8,27.1 R19.2
N$00006  (via drill 0.3)
  Top 0.4: U1.27 v13.82,26.52
  Bottom 0.4: v13.82,26.52 13.82,27.43 R20.2
N$00007  (via drill 0.3)
  Top 0.4: U1.13 v22.71,26.52
  Bottom 0.4: v22.71,26.52 v22.7,26.54 R18.2 22.75,27.55 C30.1
N$00008  (via drill 0.3)
  Top 0.4: U1.31 v11.29,26.52
  Bottom 0.4: v11.29,26.52 11.29,26.71 11,27 R22.2 10.95,27.55 C32.1
N$00009  (via drill 0.3)
  Top 0.4: U1.32 v10.65,26.52
  Bottom 0.4: v10.65,26.52 9.38,26.52 9,26.9 R23.2 8.05,27.5 C33.1
N$00010  (via drill 0.3)
  Top 0.4: U1.30 v11.92,26.52
  Bottom 0.4: v11.92,26.52 11.92,27.48 R21.2 11.95,27.55 C31.1
N$00011  (via drill 0.3)
  Top 0.4: U1.70 v20.81,8.74
  Bottom 0.4: v20.81,8.74 20.8,8.76 C6.1 20.85,9.7 R6.2
N$00012  (via drill 0.3)
  Top 0.4: U1.75 25.95,10.85 v26,10.8
  Bottom 0.4: v26,10.8 C3.1 25.95,9.9 R3.2
N$00013  (via drill 0.3)
  Top 0.4: U1.53 8.15,10.85 v8,11
  Bottom 0.4: v8,11 C8.1 8.05,12.3 R9.2
N$00014  (via drill 0.3)
  Top 0.4: U1.52 10.98,11.48 v11,11.5
  Bottom 0.4: v11,11.5 C7.1
N$00015
  Bottom 0.4: U3.3 29.32,13 29.52,12.8 R8.2 R11.2 31.55,13.55 32.4,13.55 C12.2
N$00016
  Bottom 0.4: U2.3 2.32,12 2.52,11.8 R7.2 R10.2 5.35,12.6 C9.2
N$00017
  Bottom 0.4: U4.3 2.32,22 2.52,21.8 R14.2 R15.2 5.35,22.6 C25.2
N$00025  (via drill 2.6 pad 4.5)
  other vias: 2.5,31.5
N$00026  (via drill 2.6 pad 4.5)
  other vias: 31.5,31.5
N$00027  (via drill 2.6 pad 4.5)
  other vias: 2.5,2.5
N$00028  (via drill 2.6 pad 4.5)
  other vias: 31.5,2.5
PXL_VALID  (via drill 0.3)
  Top 0.4: U1.19 v18.91,26.52
  Route2 0.2: v20.5,7.5 20.3,7.7 20.3,24.63 18.91,26.02 v18.91,26.52
  Bottom 0.25: J1.50 v20.5,7.5
SCL  (via drill 0.3)
  Top 0.4: U1.3 25.93,18.47 v26,18.4
  Route2 0.2: v25,7.5 25,18 25.4,18.4 v26,18.4
  Bottom 0.25: J1.68 v25,7.5
SDA  (via drill 0.3)
  Top 0.4: U1.4 v25.99,19.11 v26,19.1
  Route2 0.2: v24.5,7.8 24.5,18.3 25.3,19.1 v26,19.1
  Bottom 0.25: J1.66 v24.5,7.8
SS_START  (via drill 0.3)
  Top 0.4: U1.20 v18.27,26.52
  Route2 0.2: v24.5,2.5 24.5,4.5 23.8,5.2 20.9,5.2 19.8,6.3 19.8,24.5 18.27,26.02 v18.27,26.52
  Bottom 0.2: J1.65 v24.5,2.5
SS_STOP  (via drill 0.3)
  Top 0.4: U1.21 v17.64,26.52
  Route2 0.2: v23.5,2.2 23.5,4.1 22.9,4.7 19.3,4.7 19,5 19,24.66 17.64,26.02 v17.64,26.52
  Bottom 0.2: J1.61 v23.5,2.2
SYS_CLK  (via drill 0.3)
  Top 0.4: U1.18 v19.54,26.52
  Bottom 0.4: v19.54,26.52 19.54,25.54 R16.2 R17.1
SYS_CLK_EXT
  Bottom 0.2: J1.20 13,7.8 13.2,8 14.8,8 15,8.2 15,15 16,16 16,23.5 16.2,23.7 19.3,23.7 19.5,23.9 R16.1
TIME_OUT  (via drill 0.3)
  Top 0.4: U1.22 v17,26.52
  Route2 0.2: v23,2.5 23,3.9 22.7,4.2 19.1,4.2 18.5,4.8 18.5,24.52 17,26.02 v17,26.52
  Bottom 0.2: J1.59 v23,2.5
VDD_3V0  (via drill 0.3)
  Top 0.4: U1.7 v25.99,21.01 v26,21 | U1.37 9.48,21 v8.1,21
  Route15 0.4: v1.1,24.1 v1.6,24.1 v2.1,24.1 5,24.1 v8.1,21 v26,21
  Bottom 0.4: U4.1 1.02,24.1 | 1.02,24.1 1.02,24.87 C29.1 | C19.1 v26,21 C20.1 | C25.1 5.45,23.7 4.6,23.7 R15.1 4,24.1 v2.1,24.1 v1.6,24.1 | C17.1 8.1,19.5 v8.1,21 | C22.1 8.6,21.3 8.3,21 v8.1,21 | C24.1 7.4,21.4 7.8,21 v8.1,21 | 1.02,24.1 v1.1,24.1 v1.6,24.1 | U4.2 1.67,24.03 v1.6,24.1
VDD_3V3  (via drill 0.3)
  Top 0.4: U1.36 10.95,21.64 v11,21.59 | v11,21.59 v11,21.6 | U1.33 10.45,23.55 v10.5,23.6 | U1.71 v21.45,8.74 | U1.74 v23.35,8.74 | U1.55 v11.29,8.74 | U1.57 v12.55,8.74 | U1.11 25.95,23.55 v26,23.6 | U1.8 25.95,21.64 v26,21.7 | v11,16.5 11.2,16.7 11.2,21.39 v11,21.59
  Route15 0.4: v1.1,14.1 v1.6,14.1 v2.1,14.1 8.6,14.1 | 8.6,14.1 v11,16.5 | 8.6,14.1 9.9,12.8 9.9,10.13 v11.29,8.74 v12.55,8.74 12.55,9.55 13,10 21.1,10 21.45,9.64 21.45,8.76 v21.45,8.74 | v26,21.7 v26,23.6 26,25.9 v22.7,29.2 v14.8,29.2 v11.9,29.2 v11,29.2 v9,29.2 9,25.1 v10.5,23.6 10.5,22.1 v11,21.6
  Bottom 0.2: R6.1 22.4,10.7 22.6,10.5 22.6,8.74
  Bottom 0.4: 1,15.15 C13.1 1.02,14.87 1.02,14.18 v1.1,14.1 | R22.1 v11,29.2 | R21.1 v11.9,29.2 | R23.1 v9,29.2 | R19.1 v14.8,29.2 | 11.6,16.45 Q1.4 11.55,16.5 v11,16.5 10.35,16.5 C16.1 | v26,23.6 C26.1 27.85,24.15 | C9.1 5.4,13.65 4.55,13.65 R10.1 4,14.1 v2.1,14.1 v1.6,14.1 | v10.5,23.6 C27.1 11.85,23.4 C21.1 11.85,21.85 11.6,21.6 v11,21.6 | U2.2 1.67,14.03 v1.6,14.1 | U2.1 1.02,14.02 v1.1,14.1 | R18.1 v22.7,29.2 | R3.1 24.84,8.74 v23.35,8.74 22.6,8.74 v21.45,8.74 | C23.1 25.7,23 26,23.3 v26,23.6 | C28.1 25.7,24.2 26,23.9 v26,23.6 | v1.1,14.1 v1.6,14.1
VDD_4V5  (via drill 0.3)
  Top 0.4: U1.77 25.98,12.12 v26,12.1 | U1.76 25.98,11.48 v26,11.5 v26,12.1 | v26,12.1 26,12.17 28.6,14.77 | v28.6,15.1 v28.1,15.1 28.43,14.77 28.6,14.77 | v28.6,15.1 v29.1,15.1 29.1,15 28.87,14.77 28.6,14.77 | 28.6,14.77 v28.6,15.1
  Bottom 0.4: U3.1 28.02,15.1 | 28.02,15.1 28.02,15.87 C14.1 | v26,12.1 26,12.9 | 26,12.9 C11.1 | C10.1 25.95,12.95 26,12.9 | C12.1 32.35,14.6 R11.1 31.5,14.65 31.05,15.1 v29.1,15.1 v28.6,15.1 | 28.02,15.1 v28.1,15.1 v28.6,15.1 | U3.2 28.67,15.03 v28.6,15.1
Y_CLOCK  (via drill 0.3)
  Top 0.4: U1.15 v21.45,26.52
  Route2 0.2: v23,7.8 22.9,7.9 22.9,24.57 21.45,26.02 v21.45,26.52
  Bottom 0.25: J1.60 v23,7.8
Y_LOAD  (via drill 0.3)
  Top 0.4: U1.17 v20.18,26.52
  Route2 0.2: v21.5,7.8 21.9,8.2 21.9,24.3 20.18,26.02 v20.18,26.52
  Bottom 0.25: J1.54 v21.5,7.8
Y_START  (via drill 0.3)
  Top 0.4: U1.14 v22.08,26.52
  Route2 0.2: v23.5,7.5 24,8 24,24.11 22.08,26.02 v22.08,26.52
  Bottom 0.25: J1.62 v23.5,7.5

### Text on the board
tStop: IBIS5-B-1300